# Altium project 36V E-Bike Reference Design.PrjPCB (part 2 of 4)

## Sheet INVERTER.SchDoc
size B; CompanyName: Microchip Technology Inc.; Organization: Microchip Technology; Address1: 2355 West Chandler Blvd.; Address2: Chandler, AZ  85224; Address4: USA; DocumentNumber: 2; SheetNumber: 2; SheetTotal: 3; SheetTitle: MOSFET DRIVER + INVERTER; Time: Time
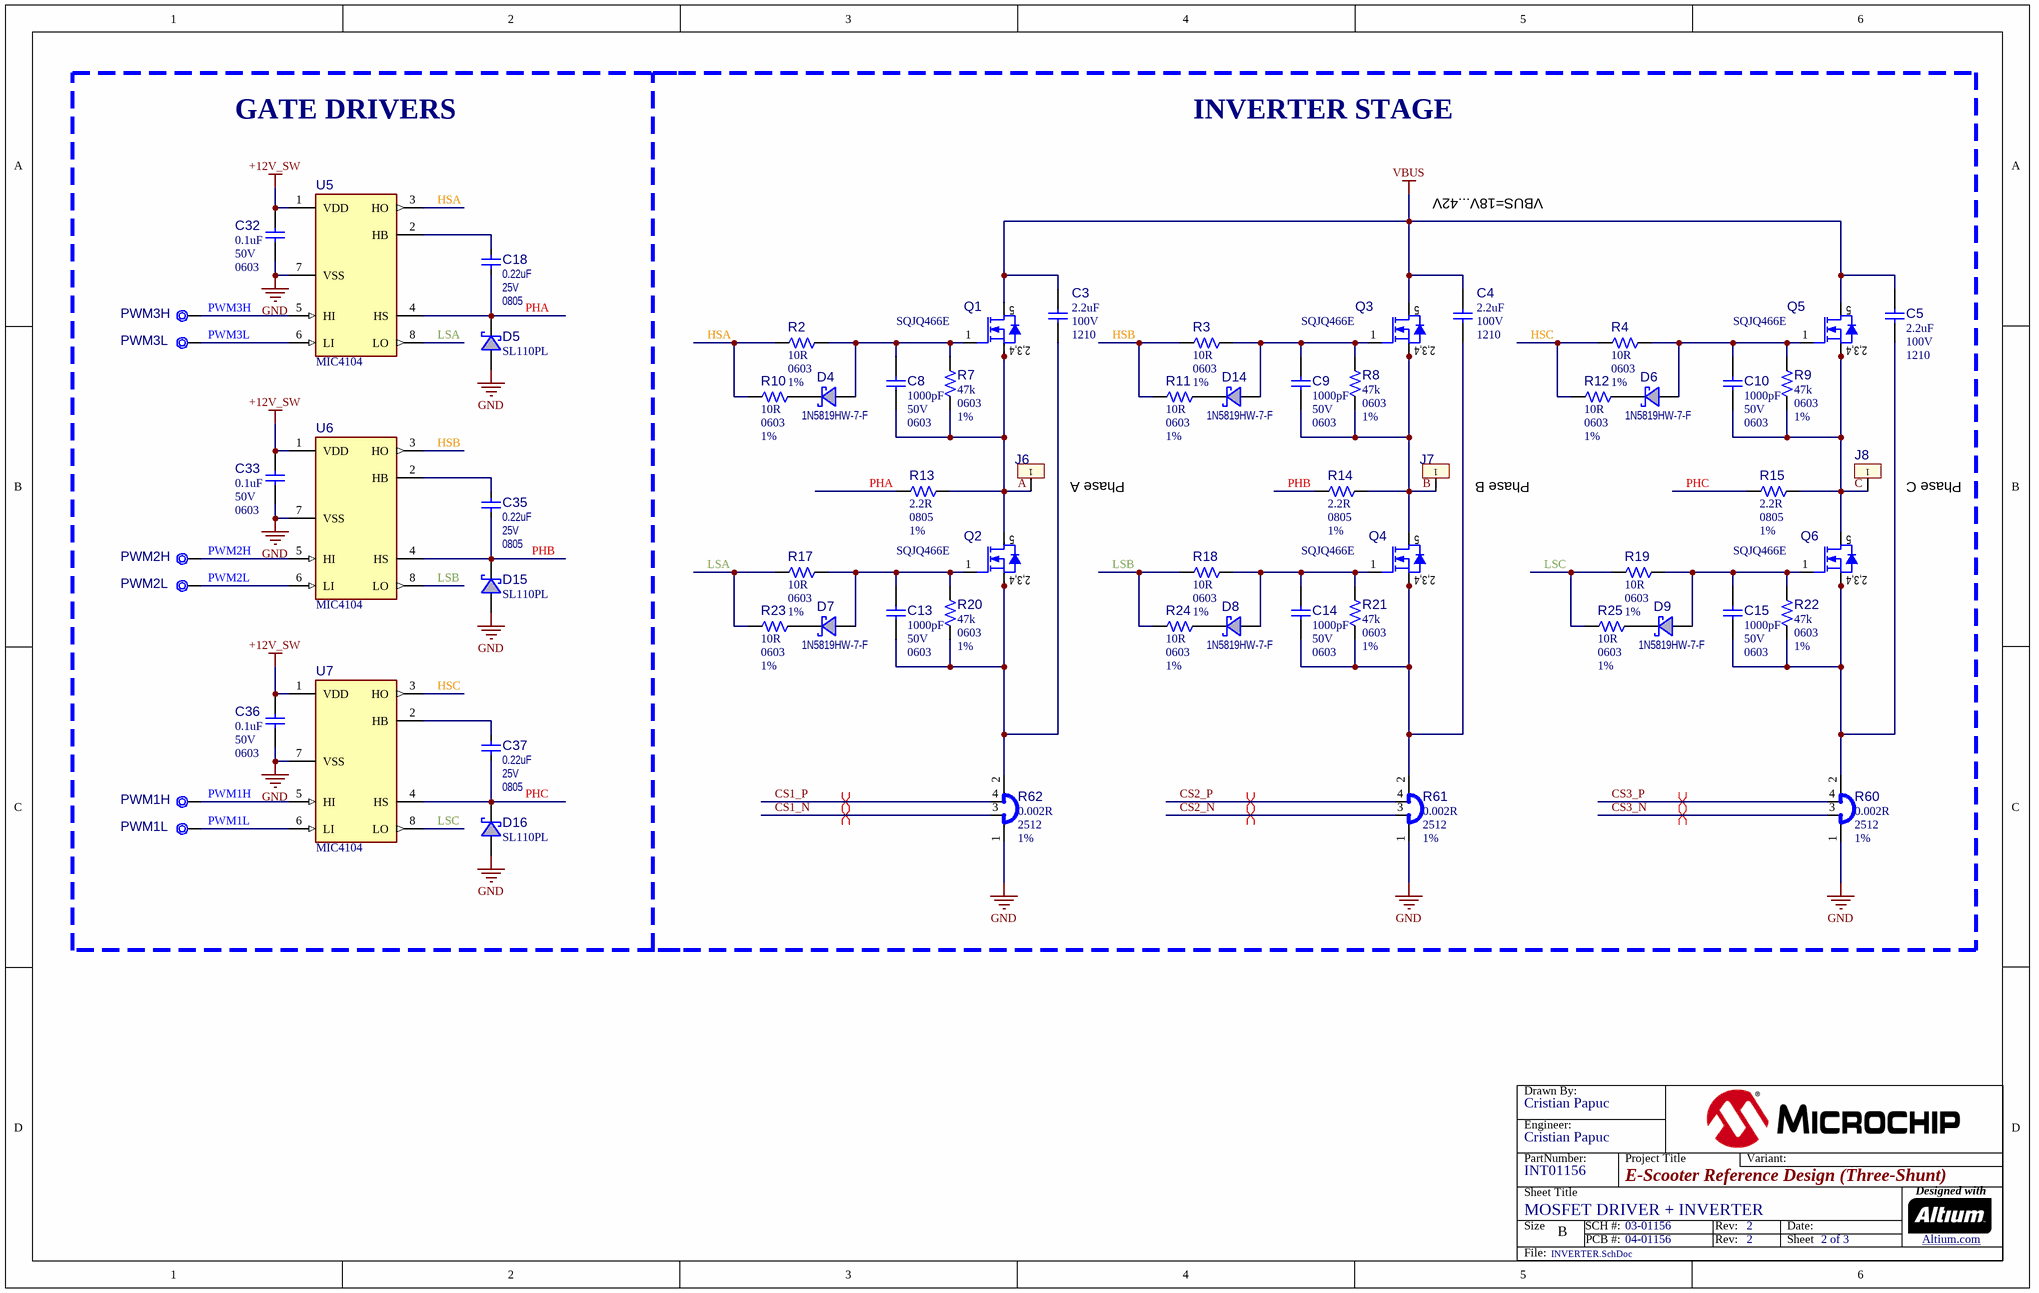
[diagram p1: INVERTER.SchDoc]

### Parts
(Parts that share a designator on the sheet are numbered #1, #2 ... from top to bottom, then left to right.)
?#2  (no value)  (graphical)
C3  value 2.2uF  Voltage: 100V  Package: 1210  [CAP_C_1210]  (hidden comment: Capacitor NP)
C4  value 2.2uF  Voltage: 100V  Package: 1210  [CAP_C_1210]  (hidden comment: Capacitor NP)
C5  value 2.2uF  Voltage: 100V  Package: 1210  [CAP_C_1210]  (hidden comment: Capacitor NP)
C8  value 1000pF  Voltage: 50V  Package: 0603  [CAP_C_0603]  (hidden comment: Capacitor NP)
C9  value 1000pF  Voltage: 50V  Package: 0603  [CAP_C_0603]  (hidden comment: Capacitor NP)
C10  value 1000pF  Voltage: 50V  Package: 0603  [CAP_C_0603]  (hidden comment: Capacitor NP)
C13  value 1000pF  Voltage: 50V  Package: 0603  [CAP_C_0603]  (hidden comment: Capacitor NP)
C14  value 1000pF  Voltage: 50V  Package: 0603  [CAP_C_0603]  (hidden comment: Capacitor NP)
C15  value 1000pF  Voltage: 50V  Package: 0603  [CAP_C_0603]  (hidden comment: Capacitor NP)
C18  value 0.22uF  Voltage: 25V  Package: 0805  [CAP_C_0805]  (hidden comment: Capacitor NP)
C32  value 0.1uF  Voltage: 50V  Package: 0603  [CAP_C_0603]  (hidden comment: Capacitor NP)
C33  value 0.1uF  Voltage: 50V  Package: 0603  [CAP_C_0603]  (hidden comment: Capacitor NP)
C35  value 0.22uF  Voltage: 25V  Package: 0805  [CAP_C_0805]  (hidden comment: Capacitor NP)
C36  value 0.1uF  Voltage: 50V  Package: 0603  [CAP_C_0603]  (hidden comment: Capacitor NP)
C37  value 0.22uF  Voltage: 25V  Package: 0805  [CAP_C_0805]  (hidden comment: Capacitor NP)
D4  value 1N5819HW-7-F  [SOD-123]  (hidden comment: Diode Schottky)
D5  value SL110PL  [SOD-123FL]  (hidden comment: Diode Schottky)
D6  value 1N5819HW-7-F  [SOD-123]  (hidden comment: Diode Schottky)
D7  value 1N5819HW-7-F  [SOD-123]  (hidden comment: Diode Schottky)
D8  value 1N5819HW-7-F  [SOD-123]  (hidden comment: Diode Schottky)
D9  value 1N5819HW-7-F  [SOD-123]  (hidden comment: Diode Schottky)
D14  value 1N5819HW-7-F  [SOD-123]  (hidden comment: Diode Schottky)
D15  value SL110PL  [SOD-123FL]  (hidden comment: Diode Schottky)
D16  value SL110PL  [SOD-123FL]  (hidden comment: Diode Schottky)
J6  Header 1x1  [CON_M_1x1_5.08_QC_TAB_SPADE_0.250_V]  (value not drawn)
J7  Header 1x1  [CON_M_1x1_5.08_QC_TAB_SPADE_0.250_V]  (value not drawn)
J8  Header 1x1  [CON_M_1x1_5.08_QC_TAB_SPADE_0.250_V]  (value not drawn)
PWM1H  Test Point No BOM  [TP_1.2x0.7]  (value not drawn)  (no BOM)
PWM1L  Test Point No BOM  [TP_1.2x0.7]  (value not drawn)  (no BOM)
PWM2H  Test Point No BOM  [TP_1.2x0.7]  (value not drawn)  (no BOM)
PWM2L  Test Point No BOM  [TP_1.2x0.7]  (value not drawn)  (no BOM)
PWM3H  Test Point No BOM  [TP_1.2x0.7]  (value not drawn)  (no BOM)
PWM3L  Test Point No BOM  [TP_1.2x0.7]  (value not drawn)  (no BOM)
Q1  value SQJQ466E  [PPAK_SO-8L_8x8_ALTERNATE]  (hidden comment: Transistor MOS-N GSSSD)
Q2  value SQJQ466E  [PPAK_SO-8L_8x8_ALTERNATE]  (hidden comment: Transistor MOS-N GSSSD)
Q3  value SQJQ466E  [PPAK_SO-8L_8x8_ALTERNATE]  (hidden comment: Transistor MOS-N GSSSD)
Q4  value SQJQ466E  [PPAK_SO-8L_8x8_ALTERNATE]  (hidden comment: Transistor MOS-N GSSSD)
Q5  value SQJQ466E  [PPAK_SO-8L_8x8_ALTERNATE]  (hidden comment: Transistor MOS-N GSSSD)
Q6  value SQJQ466E  [PPAK_SO-8L_8x8_ALTERNATE]  (hidden comment: Transistor MOS-N GSSSD)
R2  value 10R  Package: 0603  Tolerance: 1%  [RES_C_0603]  (hidden comment: Resistor)
R3  value 10R  Package: 0603  Tolerance: 1%  [RES_C_0603]  (hidden comment: Resistor)
R4  value 10R  Package: 0603  Tolerance: 1%  [RES_C_0603]  (hidden comment: Resistor)
R7  value 47k  Package: 0603  Tolerance: 1%  [RES_C_0603]  (hidden comment: Resistor)
R8  value 47k  Package: 0603  Tolerance: 1%  [RES_C_0603]  (hidden comment: Resistor)
R9  value 47k  Package: 0603  Tolerance: 1%  [RES_C_0603]  (hidden comment: Resistor)
R10  value 10R  Package: 0603  Tolerance: 1%  [RES_C_0603]  (hidden comment: Resistor)
R11  value 10R  Package: 0603  Tolerance: 1%  [RES_C_0603]  (hidden comment: Resistor)
R12  value 10R  Package: 0603  Tolerance: 1%  [RES_C_0603]  (hidden comment: Resistor)
R13  value 2.2R  Package: 0805  Tolerance: 1%  [RES_C_0805]  (hidden comment: Resistor)
R14  value 2.2R  Package: 0805  Tolerance: 1%  [RES_C_0805]  (hidden comment: Resistor)
R15  value 2.2R  Package: 0805  Tolerance: 1%  [RES_C_0805]  (hidden comment: Resistor)
R17  value 10R  Package: 0603  Tolerance: 1%  [RES_C_0603]  (hidden comment: Resistor)
R18  value 10R  Package: 0603  Tolerance: 1%  [RES_C_0603]  (hidden comment: Resistor)
R19  value 10R  Package: 0603  Tolerance: 1%  [RES_C_0603]  (hidden comment: Resistor)
R20  value 47k  Package: 0603  Tolerance: 1%  [RES_C_0603]  (hidden comment: Resistor)
R21  value 47k  Package: 0603  Tolerance: 1%  [RES_C_0603]  (hidden comment: Resistor)
R22  value 47k  Package: 0603  Tolerance: 1%  [RES_C_0603]  (hidden comment: Resistor)
R23  value 10R  Package: 0603  Tolerance: 1%  [RES_C_0603]  (hidden comment: Resistor)
R24  value 10R  Package: 0603  Tolerance: 1%  [RES_C_0603]  (hidden comment: Resistor)
R25  value 10R  Package: 0603  Tolerance: 1%  [RES_C_0603]  (hidden comment: Resistor)
R60  value 0.002R  Package: 2512  Tolerance: 1%  [RES_C_2512_SHUNT_Metal]  (hidden comment: Shunt 4 Pin)
R61  value 0.002R  Package: 2512  Tolerance: 1%  [RES_C_2512_SHUNT_Metal]  (hidden comment: Shunt 4 Pin)
R62  value 0.002R  Package: 2512  Tolerance: 1%  [RES_C_2512_SHUNT_Metal]  (hidden comment: Shunt 4 Pin)
U5  value MIC4104  [SOIC-8]  (hidden comment: MIC4104 SOIC-8)
U6  value MIC4104  [SOIC-8]  (hidden comment: MIC4104 SOIC-8)
U7  value MIC4104  [SOIC-8]  (hidden comment: MIC4104 SOIC-8)

### Blocks framed on the sheet
INVERTER STAGE: C3-C5 C8-C10 C13-C15 D4 D6-D9 D14 J6-J8 Q1-Q6 R2-R4 R7-R15 R17-R25 R60-R62

### Nets
+12V_SW: C32.2 C33.2 C36.2 U5.1(VDD) U6.1(VDD) U7.1(VDD)
GND: C32.1 C33.1 C36.1 D5.1(A) D15.1(A) D16.1(A) R60.1 R61.1 R62.1 U5.7(VSS) U6.7(VSS) U7.7(VSS)
VBUS: C3.2 C4.2 C5.2 Q1.5(D) Q3.5(D) Q5.5(D)
A: C8.1 J6.1 Q1.2(S) Q1.3(S) Q1.4(S) Q2.5(D) R7.1 R13.2
B: C9.1 J7.1 Q3.2(S) Q3.3(S) Q3.4(S) Q4.5(D) R8.1 R14.2
C: C10.1 J8.1 Q5.2(S) Q5.3(S) Q5.4(S) Q6.5(D) R9.1 R15.2
CS1_N: R62.3
CS1_P: R62.4
CS2_N: R61.3
CS2_P: R61.4
CS3_N: R60.3
CS3_P: R60.4
HSA: R2.1 R10.1 U5.3(HO)
HSB: R3.1 R11.1 U6.3(HO)
HSC: R4.1 R12.1 U7.3(HO)
LSA: R17.1 R23.1 U5.8(LO)
LSB: R18.1 R24.1 U6.8(LO)
LSC: R19.1 R25.1 U7.8(LO)
PHA: C18.1 D5.2(K) R13.1 U5.4(HS)
PHB: C35.1 D15.2(K) R14.1 U6.4(HS)
PHC: C37.1 D16.2(K) R15.1 U7.4(HS)
PWM1H: PWM1H.1 U7.5(HI)
PWM1L: PWM1L.1 U7.6(LI)
PWM2H: PWM2H.1 U6.5(HI)
PWM2L: PWM2L.1 U6.6(LI)
PWM3H: PWM3H.1 U5.5(HI)
PWM3L: PWM3L.1 U5.6(LI)
NetC3_1: C3.1 C13.1 Q2.2(S) Q2.3(S) Q2.4(S) R20.1 R62.2
NetC4_1: C4.1 C14.1 Q4.2(S) Q4.3(S) Q4.4(S) R21.1 R61.2
NetC5_1: C5.1 C15.1 Q6.2(S) Q6.3(S) Q6.4(S) R22.1 R60.2
NetC8_2: C8.2 D4.1(A) Q1.1(G) R2.2 R7.2
NetC9_2: C9.2 D14.1(A) Q3.1(G) R3.2 R8.2
NetC10_2: C10.2 D6.1(A) Q5.1(G) R4.2 R9.2
NetC13_2: C13.2 D7.1(A) Q2.1(G) R17.2 R20.2
NetC14_2: C14.2 D8.1(A) Q4.1(G) R18.2 R21.2
NetC15_2: C15.2 D9.1(A) Q6.1(G) R19.2 R22.2
NetC18_2: C18.2 U5.2(HB)
NetC35_2: C35.2 U6.2(HB)
NetC37_2: C37.2 U7.2(HB)
NetD4_2: D4.2(K) R10.2
NetD6_2: D6.2(K) R12.2
NetD7_2: D7.2(K) R23.2
NetD8_2: D8.2(K) R24.2
NetD9_2: D9.2(K) R25.2
NetD14_2: D14.2(K) R11.2

### Layout directives
differential pair: CS1_N, CS1_P, CS2_N, CS2_P, CS3_N, CS3_P

### Notes on the sheet
- GATE DRIVERS
- VBUS=18V...42V
- (near J6) Phase A
- (near J7) Phase B
- (near J8) Phase C
- Drawn By:
- Engineer:
- PartNumber:
- Project Title
- Variant:
- Sheet Title
- Size
- B
- SCH #:
- PCB #:
- Rev:
- Date:
- Sheet
- Designed with
- Altium.com <http://go.altium.com/MicrochipLandingPage_Evaluation.html>
- File:
- (in symbol TRA1472) 2,3,4

### Library data of the parts
?#2 = Title Block B
C3-C5 = CAP1121: Capacitor; Manufacturer 1: AVX Corporation; Manufacturer Part Number 1: 12101C225KAT2A; Description_: CAP CER 2.2uF 100V 10% X7R SMD 1210; Dev Tools Status: Production; Tolerance: 10%; Temperature Coeffcient: X7R; Type: Ceramic; Owner: Mihai T(M91442); Populated: YES; MCHP-ID: CAP1121; Revision: 0; Symbol: Capacitor NP; Status: MCL Design; ComponentLink1URL: https://chn-vm-apps.microchip.com/mchprepo/parts/Datasheets/X7RDielectric.pdf; ComponentLink1Description: SVN Datasheet; ComponentLink2URL: C:\ALTIUM_WORK\00001_MCHP-CDB\Datasheets\X7RDielectric.pdf; ComponentLink2Description: Local Datasheet; ComponentLink3URL: C:\ALTIUM_WORK\00001_MCHP-CDB\Library\LibraryRefs\Capacitor NP.SchLib; ComponentLink3Description: Open Symbol; ComponentLink4URL: C:\ALTIUM_WORK\00001_MCHP-CDB\Library\Footprints\CAP_C_1210.PcbLib; ComponentLink4Description: Open Footprint; ComponentLink5Description: Open Footprint 2; ComponentLink6Description: Open Footprint 3; ComponentLink7Description: Open Footprint 4; Operating Temperature: -55C to +125C; Category: Capacitor; Manufacturer 2: KEMET; Manufacturer Part Number 2: C1210C225K1RACTU; Supplier 1: Digi-Key; Supplier Part Number 1: 478-7974-1-ND; Supplier 2: Digi-Key; Supplier Part Number 2: 399-5511-1-ND; Supplier 3: Farnell; Supplier Part Number 3: 1793832; Quantity Override: 1
C8-C10 C13-C15 = CAP2035: Manufacturer 1: TDK Corporation; Manufacturer Part Number 1: CGA3E2X7R1H102K080AA; Description_: CAP CER 1000pF 10% 50V X7R SMD 0603 AEC-Q200; Dev Tools Status: Design; Tolerance: 10%; Temperature Coeffcient: X7R; Type: Ceramic; Owner: Gabor Bihari; Populated: YES; MCHP-ID: CAP2035; Revision: 1; Symbol: Capacitor NP; Status: MCL Design; ComponentLink1URL: https://chn-vm-apps.microchip.com/mchprepo/parts/Datasheets/mlcc_automotive_general_en.pdf; ComponentLink1Description: SVN Datasheet; ComponentLink2URL: C:\ALTIUM_WORK\00001_MCHP-CDB\Datasheets\mlcc_automotive_general_en.pdf; ComponentLink2Description: Local Datasheet; ComponentLink3URL: C:\ALTIUM_WORK\00001_MCHP-CDB\Library\LibraryRefs\Capacitor NP.SchLib; ComponentLink3Description: Open Symbol; ComponentLink4URL: C:\ALTIUM_WORK\00001_MCHP-CDB\Library\Footprints\CAP_C_0603.PcbLib; ComponentLink4Description: Open Footprint; ComponentLink5Description: Open Footprint 2; ComponentLink6Description: Open Footprint 3; ComponentLink7Description: Open Footprint 4; Operating Temperature: -55°C - 125°C; Category: Capacitor; Supplier 1: Digi-Key; Supplier Part Number 1: 445-5659-1-ND; Quantity Override: 1
C18 C35 C37 = CAP0135: Manufacturer 1: Panasonic; Manufacturer Part Number 1: ECJ-2YB1E224K; Description_: CAP CER 0.22uF 25V 10% X7R SMD 0805; Dev Tools Status: Production; Tolerance: 10%; Temperature Coeffcient: X7R; Type: Ceramic; Populated: Yes; MCHP-ID: CAP0135; Revision: 1; Symbol: Capacitor NP; Status: MCL Design; ComponentLink1URL: https://chn-vm-apps.microchip.com/mchprepo/parts/Datasheets/general_B11.pdf; ComponentLink1Description: SVN Datasheet; ComponentLink2URL: C:\ALTIUM_WORK\00001_MCHP-CDB\Datasheets\general_B11.pdf; ComponentLink2Description: Local Datasheet; ComponentLink3URL: C:\ALTIUM_WORK\00001_MCHP-CDB\Library\LibraryRefs\Capacitor NP.SchLib; ComponentLink3Description: Open Symbol; ComponentLink4URL: C:\ALTIUM_WORK\00001_MCHP-CDB\Library\Footprints\CAP_C_0805.PcbLib; ComponentLink4Description: Open Footprint; ComponentLink5Description: Open Footprint 2; ComponentLink6Description: Open Footprint 3; ComponentLink7Description: Open Footprint 4; Operating Temperature: -55C to +125C; Category: Capacitor; Supplier 1: Digi-Key; Supplier Part Number 1: PCC1832CT-ND; Quantity Override: 1; Manufacturer 2: TDK; Manufacturer Part Number 2: C2012X7R1E224K; Supplier 2: Digi-Key; Supplier Part Number 2: 445-1352-1-ND
C32 C33 C36 = CAP2016: Capacitor; Manufacturer 1: AVX Corporation; Manufacturer Part Number 1: 06035C104K4Z4A; Description_: CAP CER 0.1uF 50V 10% X7R AEC-Q200 SMD 0603; Dev Tools Status: Design; Tolerance: 10%; Temperature Coeffcient: X7R; Type: Ceramic; Owner: Sam Charles; Populated: YES; MCHP-ID: CAP2016; Revision: A; Symbol: Capacitor NP; Status: MCL Design; ComponentLink1URL: https://chn-vm-apps.microchip.com/mchprepo/parts/Datasheets/FlexitermMLCC.pdf; ComponentLink1Description: SVN Datasheet; ComponentLink2URL: C:\ALTIUM_WORK\00001_MCHP-CDB\Datasheets\FlexitermMLCC.pdf; ComponentLink2Description: Local Datasheet; ComponentLink3URL: C:\ALTIUM_WORK\00001_MCHP-CDB\Library\LibraryRefs\Capacitor NP.SchLib; ComponentLink3Description: Open Symbol; ComponentLink4URL: C:\ALTIUM_WORK\00001_MCHP-CDB\Library\Footprints\CAP_C_0603.PcbLib; ComponentLink4Description: Open Footprint; ComponentLink5Description: Open Footprint 2; ComponentLink6Description: Open Footprint 3; ComponentLink7Description: Open Footprint 4; Operating Temperature: -55°C ~ 125°C; Category: Capacitor; Supplier 1: Digi-Key; Supplier Part Number 1: 478-10679-1-ND; Quantity Override: 1
D4 D6-D9 D14 = DIODE1233: DIO SCTKY RB160M-60TR 550mV 1A 60V SMD SOD-123F; Manufacturer 1: Diodes Incorporated; Description_: DIODE SCTKY 1N5819HW-7-F 450mV 1A 40V SMD SOD-123; Dev Tools Status: Design; Type: Schottky Single; Power: 450mW; Reverse Current: 1mA; Reverse Recovery Time: 500ns; Reverse Voltage: 40V; Owner: Sorin Stanoaia; Populated: YES; MCHP-ID: DIODE1233; Revision: A; Symbol: Diode Schottky; Status: MCL Design; Package: SOD-123; ComponentLink1URL: https://chn-vm-apps.microchip.com/mchprepo/parts/Datasheets/ds30217.pdf; ComponentLink1Description: SVN Datasheet; ComponentLink2URL: C:\ALTIUM_WORK\00001_MCHP-CDB\Datasheets\ds30217.pdf; ComponentLink2Description: Local Datasheet; ComponentLink3URL: C:\ALTIUM_WORK\00001_MCHP-CDB\Library\LibraryRefs\Diode Schottky.SchLib; ComponentLink3Description: Open Symbol; ComponentLink4URL: C:\ALTIUM_WORK\00001_MCHP-CDB\Library\Footprints\SOD-123.PcbLib; ComponentLink4Description: Open Footprint; ComponentLink5Description: Open Footprint 2; ComponentLink6Description: Open Footprint 3; ComponentLink7Description: Open Footprint 4; Operating Temperature: -65C to +125C; Category: Diode; Forward Current: 1A; Manufacturer Part Number 1: 1N5819HW-7-F; Supplier 1: Digi-Key; Supplier Part Number 1: 1N5819HW-FDICT-ND; Quantity Override: 1
D5 D15 D16 = DIODE1296: DIO SCTKY RB160M-60TR 550mV 1A 60V SMD SOD-123F; Manufacturer 1: Micro Commercial Co; Manufacturer Part Number 1: SL110PL-TP; Description_: DIO SCTKY  SL110PL-TP 600mV 1A 100V SOD-123FL; Dev Tools Status: Design; Type: Schottky Single; Reverse Recovery Time: 500ns; Reverse Voltage: 100V; Owner: Tad Ahlvers; Populated: YES; MCHP-ID: DIODE1296; Revision: A; Symbol: Diode Schottky; Status: MCL Design; Package: SOD-123FL; ComponentLink1URL: https://chn-vm-apps.microchip.com/mchprepo/parts/Datasheets/SL14PL-SL110PL(SOD-123FL)-A.pdf; ComponentLink1Description: SVN Datasheet; ComponentLink2URL: C:\ALTIUM_WORK\00001_MCHP-CDB\Datasheets\SL14PL-SL110PL(SOD-123FL)-A.pdf; ComponentLink2Description: Local Datasheet; ComponentLink3URL: C:\ALTIUM_WORK\00001_MCHP-CDB\Library\LibraryRefs\Diode Schottky.SchLib; ComponentLink3Description: Open Symbol; ComponentLink4URL: C:\ALTIUM_WORK\00001_MCHP-CDB\Library\Footprints\SOD-123FL.PcbLib; ComponentLink4Description: Open Footprint; ComponentLink5Description: Open Footprint 2; ComponentLink6Description: Open Footprint 3; ComponentLink7Description: Open Footprint 4; Operating Temperature: -55C to +150C; Category: Diode; Forward Current: 1A; Supplier 1: Digi-Key; Supplier Part Number 1: SL110PL-TPMSCT-ND; Quantity Override: 1
J6-J8 = CON2208: CON HDR-2.54 Male 1x1 Gold 5.97MH TH VERT; Manufacturer 1: TE Connectivity AMP Connectors; Manufacturer Part Number 1: 1-726386-2; Value: TERMINAL 1x1; Description_: CON CONTACT QC TAB 0.250 Male 1x1 TH VERT; Dev Tools Status: Design; Owner: Octavian Stroe; Populated: YES; MCHP-ID: CON2208; Revision: A; Symbol: Header 1x1; Status: MCL Design; ComponentLink1URL: https://chn-vm-apps.microchip.com/mchprepo/parts/Datasheets/ENG_CD_726386_G1.pdf; ComponentLink1Description: SVN Datasheet; ComponentLink2URL: C:\ALTIUM_WORK\00001_MCHP-CDB\Datasheets\ENG_CD_726386_G1.pdf; ComponentLink2Description: Local Datasheet; ComponentLink3URL: C:\ALTIUM_WORK\00001_MCHP-CDB\Library\LibraryRefs\Header 1x1.SchLib; ComponentLink3Description: Open Symbol; ComponentLink4URL: C:\ALTIUM_WORK\00001_MCHP-CDB\Library\Footprints\CON_M_1x1_5.08_QC_TAB_SPADE_0.250_V.PcbLib; ComponentLink4Description: Open Footprint; ComponentLink5Description: Open Footprint 2; ComponentLink6Description: Open Footprint 3; ComponentLink7Description: Open Footprint 4; Type: Contact; Category: Connector; Supplier 1: Digi-Key; Supplier Part Number 1: A122560-ND; Quantity Override: 1
PWM1H PWM1L PWM2H PWM2L PWM3H PWM3L = CON1128: Test Point; Value: TP PAD PCB 1.2x0.7; Description_: CON TP PAD PCB 1.2x0.7 TH; Dev Tools Status: Production; Owner: Bogdan P (M91398); Populated: Yes; MCHP-ID: CON1128; Revision: 0; Status: MCL Design; ComponentLink1Description: SVN Datasheet; Type: Test Point; Category: Connector; Quantity Override: 1; ComponentLink2Description: Local Datasheet; ComponentLink3Description: Open Symbol; ComponentLink3URL: C:\ALTIUM_WORK\00001_MCHP-CDB\Library\LibraryRefs\Test Point No BOM.SchLib; ComponentLink4Description: Open Footprint; ComponentLink4URL: C:\ALTIUM_WORK\00001_MCHP-CDB\Library\Footprints\TP_1.2x0.7.PcbLib; ComponentLink5Description: Open Footprint 2; ComponentLink6Description: Open Footprint 3; ComponentLink7Description: Open Footprint 4; Symbol: Test Point No BOM
Q1-Q6 = TRA1472: Transistor MOS; Manufacturer 1: Vishay Siliconix; Manufacturer Part Number 1: SQJQ466E-T1_GE3; Description_: TRANS FET N-CH SQJQ466E 60V 200A PowerPAK SO-8L AEC-Q101; Dev Tools Status: Design; Type: FET; Current: 200A; Drain to Source Voltage: 60V; Gate to Source Voltage: 20V; Power: 150W; Owner: Octavian Stroe; Populated: YES; MCHP-ID: TRA1472; Revision: 1; Symbol: Transistor MOS-N GSSSD; Status: MCL Design; Package: PowerPAK SO-8L; ComponentLink1URL: https://chn-vm-apps.microchip.com/mchprepo/parts/Datasheets/sqjq466e.pdf; ComponentLink1Description: SVN Datasheet; ComponentLink2URL: C:\ALTIUM_WORK\00001_MCHP-CDB\Datasheets\sqjq466e.pdf; ComponentLink2Description: Local Datasheet; ComponentLink3URL: C:\ALTIUM_WORK\00001_MCHP-CDB\Library\LibraryRefs\Transistor MOS-N GSSSD.SchLib; ComponentLink3Description: Open Symbol; ComponentLink4URL: C:\ALTIUM_WORK\00001_MCHP-CDB\Library\Footprints\PPAK_SO-8L_8x8.PcbLib; ComponentLink4Description: Open Footprint; ComponentLink5Description: Open Footprint 2; ComponentLink6Description: Open Footprint 3; ComponentLink7Description: Open Footprint 4; Category: Transistor; Voltage: 60V; Supplier 1: Digi-Key; Supplier Part Number 1: SQJQ466E-T1_GE3CT-ND; Quantity Override: 1; ComponentLink7URL: C:\ALTIUM_WORK\00001_MCHP-CDB\Library\Footprints\PPAK_SO-8L_8x8_ALTERNATE.PcbLib; Operating Temperature: -55C to +175C
R2-R4 R10-R12 R23-R25 = RSMT0456: Manufacturer 1: Panasonic; Manufacturer Part Number 1: ERJ-3EKF10R0V; Description_: RES TKF 10R 1% 1/10W SMD 0603; Dev Tools Status: Production; Voltage: 75V; Temperature Coeffcient: 100ppm/C; Power: 1/10W; Populated: Yes; MCHP-ID: RSMT0456; Revision: 2; Symbol: Resistor; Status: MCL Design; ComponentLink1URL: https://chn-vm-apps.microchip.com/mchprepo/parts/Datasheets/AOA0000CE2.pdf; ComponentLink1Description: SVN Datasheet; ComponentLink2URL: C:\ALTIUM_WORK\00001_MCHP-CDB\Datasheets\AOA0000CE2.pdf; ComponentLink2Description: Local Datasheet; ComponentLink3URL: C:\ALTIUM_WORK\00001_MCHP-CDB\Library\LibraryRefs\Resistor.SchLib; ComponentLink3Description: Open Symbol; ComponentLink4URL: C:\ALTIUM_WORK\00001_MCHP-CDB\Library\Footprints\RES_C_0603.PcbLib; ComponentLink4Description: Open Footprint; ComponentLink5Description: Open Footprint 2; ComponentLink6Description: Open Footprint 3; ComponentLink7Description: Open Footprint 4; Operating Temperature: -55C to +155C; Category: Resistor; Type: RES SMD; Composition: TKF; Manufacturer 2: Yageo; Manufacturer Part Number 2: RC0603FR-0710RL; Manufacturer 3: SET; Manufacturer Part Number 3: RMCF1/1610.01%TR; Supplier 1: Digi-Key; Supplier Part Number 1: P10.0HTR-ND; Supplier 2: Digi-Key; Supplier Part Number 2: 311-10.0HRCT-ND; Supplier 3: SET; Supplier Part Number 3: RMCF1/1610.01%TR; Quantity Override: 1
R7-R9 R20-R22 = RES1183: Manufacturer 1: Panasonic; Manufacturer Part Number 1: ERJ-3EKF4702V; Description_: RES TKF 47k 1% 1/10W SMD 0603; Dev Tools Status: Production; Voltage: 75V; Temperature Coeffcient: 100ppm/C; Power: 1/10W; Populated: YES; Owner: Adrian M (M91404); MCHP-ID: RES1183; Revision: 0; Symbol: Resistor; Status: MCL Design; ComponentLink1URL: https://chn-vm-apps.microchip.com/mchprepo/parts/Datasheets/AOA0000CE2.pdf; ComponentLink1Description: SVN Datasheet; ComponentLink2URL: C:\ALTIUM_WORK\00001_MCHP-CDB\Datasheets\AOA0000CE2.pdf; ComponentLink2Description: Local Datasheet; ComponentLink3URL: C:\ALTIUM_WORK\00001_MCHP-CDB\Library\LibraryRefs\Resistor.SchLib; ComponentLink3Description: Open Symbol; ComponentLink4URL: C:\ALTIUM_WORK\00001_MCHP-CDB\Library\Footprints\RES_C_0603.PcbLib; ComponentLink4Description: Open Footprint; ComponentLink5Description: Open Footprint 2; ComponentLink6Description: Open Footprint 3; ComponentLink7Description: Open Footprint 4; Operating Temperature: -55C to +155C; Category: Resistor; Type: RES SMD; Composition: TKF; Supplier 1: Digi-Key; Supplier Part Number 1: P47.0KHCT-ND; Quantity Override: 1
R13-R15 = RES2048: Manufacturer 1: Vishay Dale; Manufacturer Part Number 1: CRCW08052R20FKEA; Description_: RES TKF 2.2R 1% 1/8W SMD 0805 AEC-Q200; Dev Tools Status: Production; Voltage: 150V; Temperature Coeffcient: 100ppm/C; Power: 1/8W; Owner: Cristian Papuc; Populated: YES; MCHP-ID: RES2048; Revision: 1; Symbol: Resistor; Status: MCL Design; ComponentLink1URL: https://chn-vm-apps.microchip.com/mchprepo/parts/Datasheets/dcrcwe3.pdf; ComponentLink1Description: SVN Datasheet; ComponentLink2URL: C:\ALTIUM_WORK\00001_MCHP-CDB\Datasheets\dcrcwe3.pdf; ComponentLink2Description: Local Datasheet; ComponentLink3URL: C:\ALTIUM_WORK\00001_MCHP-CDB\Library\LibraryRefs\Resistor.SchLib; ComponentLink3Description: Open Symbol; ComponentLink4URL: C:\ALTIUM_WORK\00001_MCHP-CDB\Library\Footprints\RES_C_0805.PcbLib; ComponentLink4Description: Open Footprint; ComponentLink5Description: Open Footprint 2; ComponentLink6Description: Open Footprint 3; ComponentLink7Description: Open Footprint 4; Operating Temperature: -55C to +155C; Category: Resistor; Type: RES SMD; Composition: TKF; Supplier 1: Digi-Key; Supplier Part Number 1: 541-2.20CCCT-ND; Quantity Override: 1
R17-R19 = RSMT0456: Manufacturer 1: Panasonic; Manufacturer Part Number 1: ERJ-3EKF10R0V; Description_: RES TKF 10R 1% 1/10W SMD 0603; Dev Tools Status: Production; Temperature Coeffcient: 100ppm/C; Populated: Yes; Voltage: 75V; Power: 1/10W; MCHP-ID: RSMT0456; Revision: 2; Symbol: Resistor; Status: MCL Design; ComponentLink1URL: https://chn-vm-apps.microchip.com/mchprepo/parts/Datasheets/AOA0000CE2.pdf; ComponentLink1Description: SVN Datasheet; ComponentLink2URL: C:\ALTIUM_WORK\00001_MCHP-CDB\Datasheets\AOA0000CE2.pdf; ComponentLink2Description: Local Datasheet; ComponentLink3URL: C:\ALTIUM_WORK\00001_MCHP-CDB\Library\LibraryRefs\Resistor.SchLib; ComponentLink3Description: Open Symbol; ComponentLink4URL: C:\ALTIUM_WORK\00001_MCHP-CDB\Library\Footprints\RES_C_0603.PcbLib; ComponentLink4Description: Open Footprint; ComponentLink5Description: Open Footprint 2; ComponentLink6Description: Open Footprint 3; ComponentLink7Description: Open Footprint 4; Operating Temperature: -55C to +155C; Category: Resistor; Type: RES SMD; Composition: TKF; Supplier 1: Digi-Key; Supplier Part Number 1: P10.0HTR-ND; Quantity Override: 1; Manufacturer 2: Yageo; Manufacturer Part Number 2: RC0603FR-0710RL; Manufacturer 3: SET; Manufacturer Part Number 3: RMCF1/1610.01%TR; Supplier 2: Digi-Key; Supplier Part Number 2: 311-10.0HRCT-ND; Supplier 3: SET; Supplier Part Number 3: RMCF1/1610.01%TR
R60-R62 = RES2539: Shunt; Manufacturer 1: Vishay Dale; Manufacturer Part Number 1: WSLF25122L000FEA; Description_: RES SHUNT ME 0.002R 1% 5W AEC-Q200 SMD 2512; Dev Tools Status: Design; Temperature Coeffcient: 70ppm/C; Power: 5W; Owner: Octavian Stroe; Populated: YES; MCHP-ID: RES2539; Revision: B; Symbol: Shunt 4 Pin; Status: MCL Design; ComponentLink1URL: https://chn-vm-apps.microchip.com/mchprepo/parts/Datasheets/wslf.pdf; ComponentLink1Description: SVN Datasheet; ComponentLink2URL: C:\ALTIUM_WORK\00001_MCHP-CDB\Datasheets\wslf.pdf; ComponentLink2Description: Local Datasheet; ComponentLink3URL: C:\ALTIUM_WORK\00001_MCHP-CDB\Library\LibraryRefs\Shunt 4 Pin.SchLib; ComponentLink3Description: Open Symbol; ComponentLink4URL: C:\ALTIUM_WORK\00001_MCHP-CDB\Library\Footprints\RES_C_2512_SHUNT_Metal.PcbLib; ComponentLink4Description: Open Footprint; ComponentLink5Description: Open Footprint 2; ComponentLink6Description: Open Footprint 3; ComponentLink7Description: Open Footprint 4; Operating Temperature: -65C to +170C; Category: Resistor; Type: Shunt; Composition: Metal Element; Supplier 1: Digi-Key; Supplier Part Number 1: 541-3126-1-ND; Quantity Override: 1
U5-U7 = MIC6432: MOSFET DRIVER; Manufacturer 1: Micrel Inc; Manufacturer Part Number 1: MIC4104YM; Description_: MCHP ANALOG FET DRIVER Dual-Non-Inverting MIC4104 SOIC-8; MAPS Description: 100V HalfBridge MOSFET Driver 3/2A SOURCE/SINK CURRENT TTL INPUT; Dev Tools Status: Design; Owner: Ed Kennedy; MPC: 2780143BXE01; LeadContent: Pb-FREE; PackingMedia: TUBE; Stage: REL; LeadCount: 8; PackageWidth: 3.90mm(.150in); ForceMinOrderQtyMult: False; MinOrderQty: 1; TempRange: -40C to +125C; tblDeviceFamilyID: 7802; PeakOutputCurrent: 3.0/2.0; Populated: YES; MCHP-ID: MIC6432; Symbol: MIC4104 SOIC-8; Type: FET Driver; Status: MCL Design; Revision: A; Category: MCHP-Analog; ComponentLink1URL: http://www.microchip.com/wwwproducts/MIC4104; ComponentLink1Description: SVN Datasheet; ComponentLink2Description: Local Datasheet; ComponentLink3URL: C:\ALTIUM_WORK\00001_MCHP-CDB\Library\LibraryRefs\MIC4104 SOIC-8.SchLib; ComponentLink3Description: Open Symbol; ComponentLink4URL: C:\ALTIUM_WORK\00001_MCHP-CDB\Library\Footprints\SOIC-8.PcbLib; ComponentLink4Description: Open Footprint; ComponentLink5Description: Open Footprint 2; ComponentLink6Description: Open Footprint 3; ComponentLink7Description: Open Footprint 4; Supplier 1: Digi-Key; Supplier Part Number 1: 576-1590-ND; IntroductionDate: 2007-01-08; PackageType: SOIC; Quantity Override: 1; ComponentLink2URL: C:\ALTIUM_WORK\00001_MCHP-CDB\Datasheets\mic4103-4.pdf

## Sheet POWER+HALL.SchDoc
size B; CompanyName: Microchip Technology Inc.; Organization: Microchip Technology; Address1: 2355 West Chandler Blvd.; Address2: Chandler, AZ  85224; Address4: USA; DocumentNumber: 3; SheetNumber: 3; SheetTotal: 3; SheetTitle: POWER+HALL; Time: Time
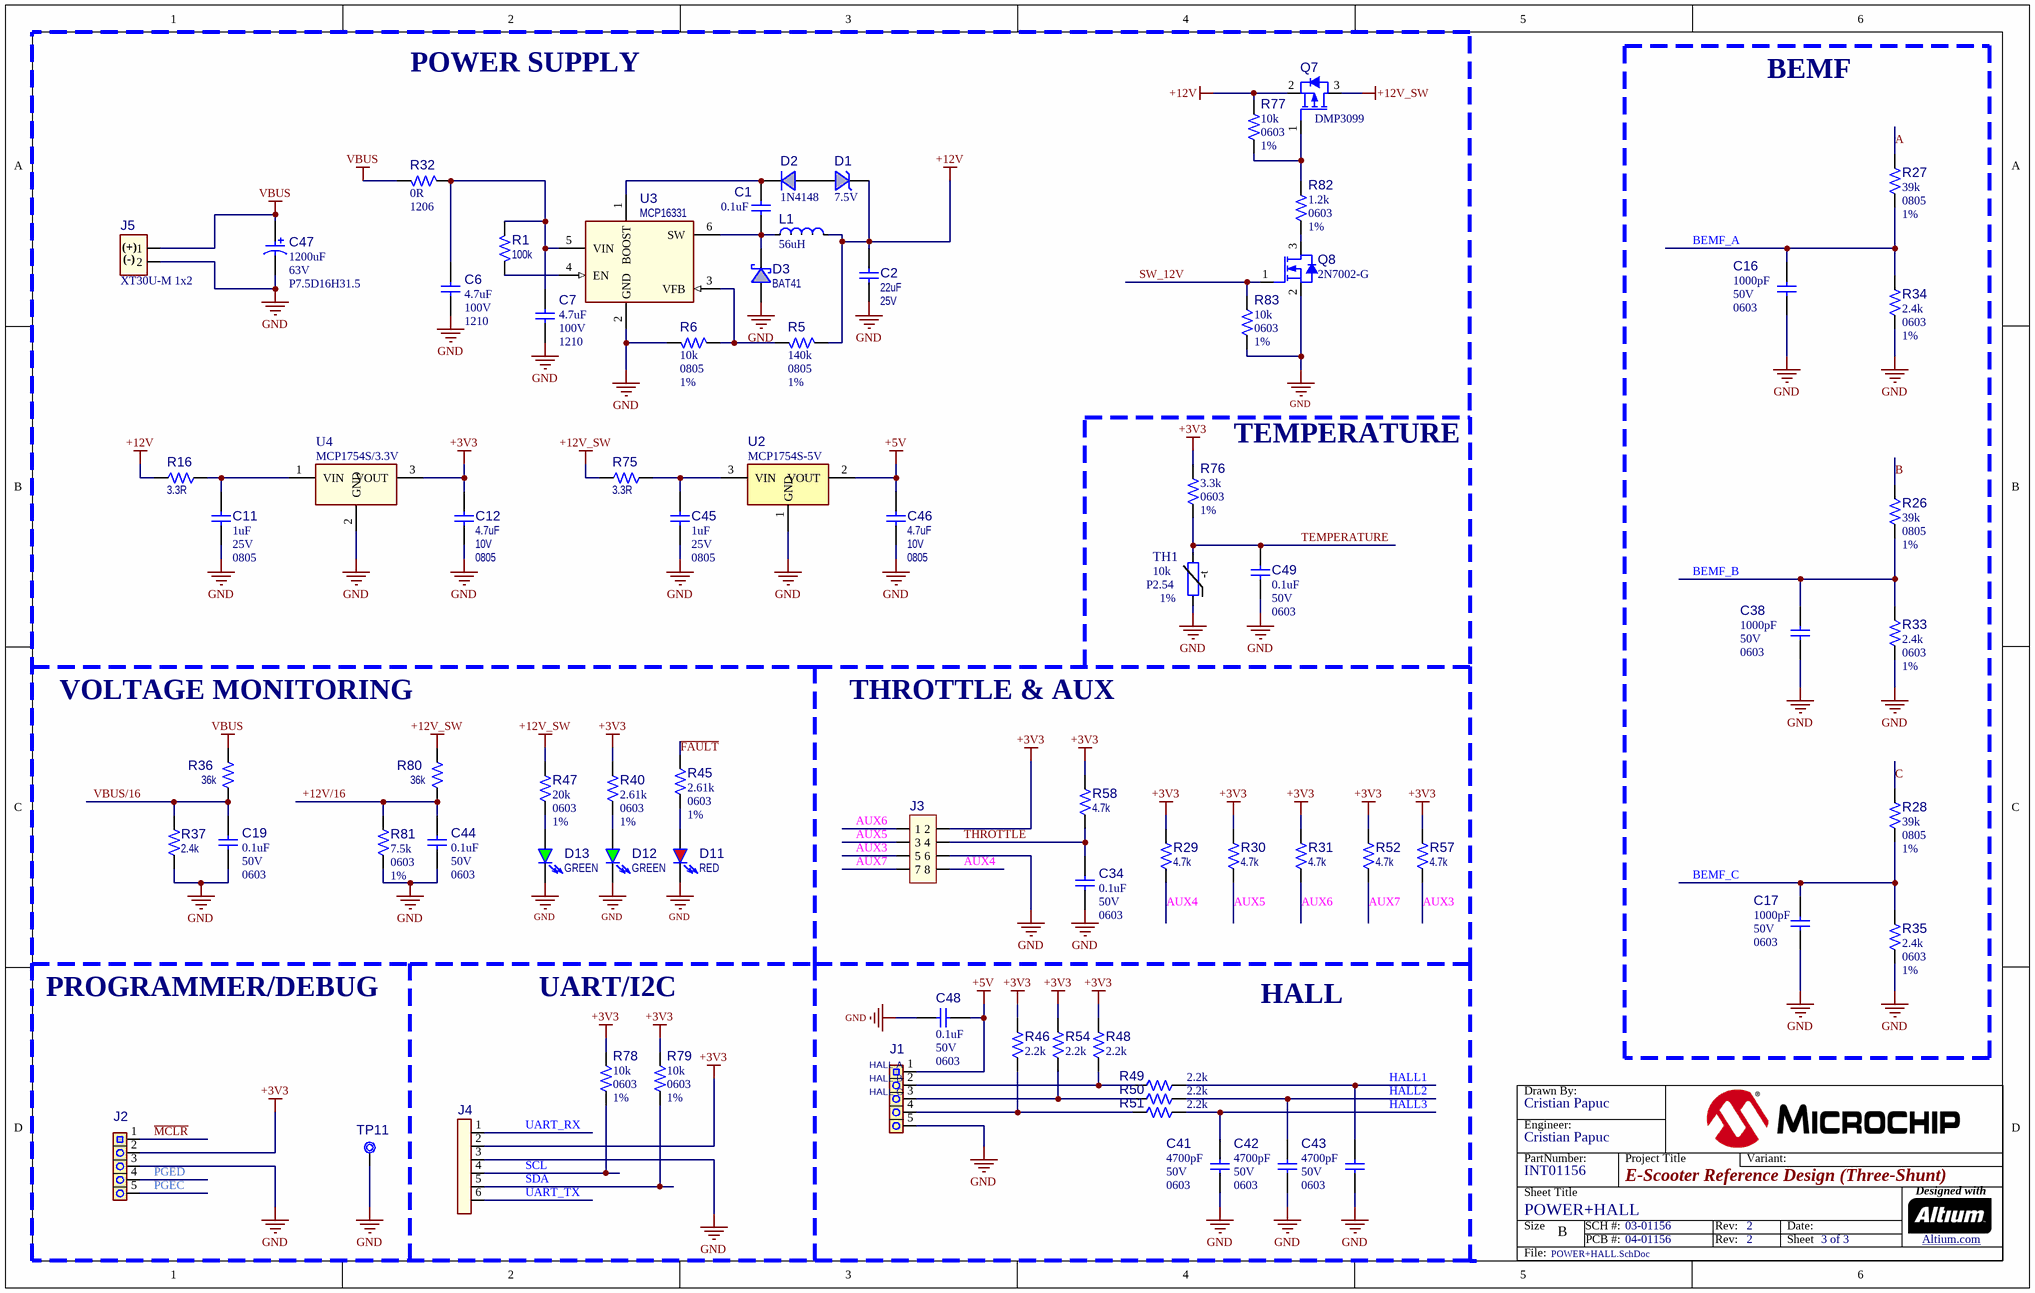
[diagram p2: POWER+HALL.SchDoc]

### Parts
(Parts that share a designator on the sheet are numbered #1, #2 ... from top to bottom, then left to right.)
?#3  (no value)  (graphical)
C1  value 0.1uF  [CAP_C_0603]  (hidden comment: Capacitor NP)
C2  value 22uF  Voltage: 25V  [CAP_C_1206]  (hidden comment: Capacitor NP)
C6  value 4.7uF  Voltage: 100V  Package: 1210  [CAP_C_1210]  (hidden comment: Capacitor NP)
C7  value 4.7uF  Voltage: 100V  Package: 1210  [CAP_C_1210]  (hidden comment: Capacitor NP)
C11  value 1uF  Voltage: 25V  Package: 0805  [CAP_C_0805]  (hidden comment: Capacitor NP)
C12  value 4.7uF  Voltage: 10V  Package: 0805  [CAP_C_0805]  (hidden comment: Capacitor NP)
C16  value 1000pF  Voltage: 50V  Package: 0603  [CAP_C_0603]  (hidden comment: Capacitor NP)
C17  value 1000pF  Voltage: 50V  Package: 0603  [CAP_C_0603]  (hidden comment: Capacitor NP)
C19  value 0.1uF  Voltage: 50V  Package: 0603  [CAP_C_0603]  (hidden comment: Capacitor NP)
C34  value 0.1uF  Voltage: 50V  Package: 0603  [CAP_C_0603]  (hidden comment: Capacitor NP)
C38  value 1000pF  Voltage: 50V  Package: 0603  [CAP_C_0603]  (hidden comment: Capacitor NP)
C41  value 4700pF  Voltage: 50V  Package: 0603  [CAP_C_0603]  (hidden comment: Capacitor NP)
C42  value 4700pF  Voltage: 50V  Package: 0603  [CAP_C_0603]  (hidden comment: Capacitor NP)
C43  value 4700pF  Voltage: 50V  Package: 0603  [CAP_C_0603]  (hidden comment: Capacitor NP)
C44  value 0.1uF  Voltage: 50V  Package: 0603  [CAP_C_0603]  (hidden comment: Capacitor NP)
C45  value 1uF  Voltage: 25V  Package: 0805  [CAP_C_0805]  (hidden comment: Capacitor NP)
C46  value 4.7uF  Voltage: 10V  Package: 0805  [CAP_C_0805]  (hidden comment: Capacitor NP)
C47  value 1200uF  Voltage: 63V  Package: P7.5D16H31.5  [CAP_RAD_P7.5D16H31.5]  (hidden comment: Capacitor POL)
C48  value 0.1uF  Voltage: 50V  Package: 0603  [CAP_C_0603]  (hidden comment: Capacitor NP)
C49  value 0.1uF  Voltage: 50V  Package: 0603  [CAP_C_0603]  (hidden comment: Capacitor NP)
D1  value 7.5V  [SOD-123]  (hidden comment: Diode Zener)
D2  value 1N4148  [SOD-323]  (hidden comment: Diode Single)
D3  value BAT41  [SOD-123]  (hidden comment: Diode Schottky)
D11  value RED  [LED_0603_RED]  (hidden comment: LED_red)
D12  value GREEN  [LED_0603_GREEN]  (hidden comment: LED_green)
D13  value GREEN  [LED_0603_GREEN]  (hidden comment: LED_green)
J1  Header 1x5  [HDR_M_2.54_1x5]  (value not drawn)
J2  Header 1x5  [HDR_M_2.54_1x5]  (value not drawn)
J3  Header 2x4  [HDR_M_2.54_2x4]  (value not drawn)
J4  Header 1x6  [HDR_M_2.54_1x6]  (value not drawn)
J5  value XT30U-M 1x2  [CON TERMINAL XT30U-M 5mm 1x2 Male 30A TH V]  (hidden comment: CON 1x2 POLARIZED)
L1  value 56uH  [IND_WE_WE-PD_L7.3W7.3H4.5]  (hidden comment: Inductor)
Q7  value DMP3099  [SOT-23-3]  (hidden comment: Transistor MOS-P GSD)
Q8  value 2N7002-G  [SOT-23-3]  (hidden comment: Transistor MOS-N GSD)
R1  value 100k  [RES_C_0603]  (hidden comment: Resistor)
R5  value 140k  Package: 0805  Tolerance: 1%  [RES_C_0805]  (hidden comment: Resistor)
R6  value 10k  Package: 0805  Tolerance: 1%  [RES_C_0805]  (hidden comment: Resistor)
R16  value 3.3R  [RES_C_0805]  (hidden comment: Resistor)
R26  value 39k  Package: 0805  Tolerance: 1%  [RES_C_0805]  (hidden comment: Resistor)
R27  value 39k  Package: 0805  Tolerance: 1%  [RES_C_0805]  (hidden comment: Resistor)
R28  value 39k  Package: 0805  Tolerance: 1%  [RES_C_0805]  (hidden comment: Resistor)
R29  value 4.7k  [RES_C_0603]  (hidden comment: Resistor)
R30  value 4.7k  [RES_C_0603]  (hidden comment: Resistor)
R31  value 4.7k  [RES_C_0603]  (hidden comment: Resistor)
R32  value 0R  Package: 1206  [RES_C_1206]  (hidden comment: Resistor)
R33  value 2.4k  Package: 0603  Tolerance: 1%  [RES_C_0603]  (hidden comment: Resistor)
R34  value 2.4k  Package: 0603  Tolerance: 1%  [RES_C_0603]  (hidden comment: Resistor)
R35  value 2.4k  Package: 0603  Tolerance: 1%  [RES_C_0603]  (hidden comment: Resistor)
R36  value 36k  [RES_C_0805]  (hidden comment: Resistor)
R37  value 2.4k  [RES_C_0603]  (hidden comment: Resistor)
R40  value 2.61k  Package: 0603  Tolerance: 1%  [RES_C_0603]  (hidden comment: Resistor)
R45  value 2.61k  Package: 0603  Tolerance: 1%  [RES_C_0603]  (hidden comment: Resistor)
R46  value 2.2k  [RES_C_0603]  (hidden comment: Resistor)
R47  value 20k  Package: 0603  Tolerance: 1%  [RES_C_0603]  (hidden comment: Resistor)
R48  value 2.2k  [RES_C_0603]  (hidden comment: Resistor)
R49  value 2.2k  [RES_C_0603]  (hidden comment: Resistor)
R50  value 2.2k  [RES_C_0603]  (hidden comment: Resistor)
R51  value 2.2k  [RES_C_0603]  (hidden comment: Resistor)
R52  value 4.7k  [RES_C_0603]  (hidden comment: Resistor)
R54  value 2.2k  [RES_C_0603]  (hidden comment: Resistor)
R57  value 4.7k  [RES_C_0603]  (hidden comment: Resistor)
R58  value 4.7k  [RES_C_0603]  (hidden comment: Resistor)
R75  value 3.3R  [RES_C_0805]  (hidden comment: Resistor)
R76  value 3.3k  Package: 0603  Tolerance: 1%  [RES_C_0603]  (hidden comment: Resistor)
R77  value 10k  Package: 0603  Tolerance: 1%  [RES_C_0603]  (hidden comment: Resistor)
R78  value 10k  Package: 0603  Tolerance: 1%  [RES_C_0603]  (hidden comment: Resistor)
R79  value 10k  Package: 0603  Tolerance: 1%  [RES_C_0603]  (hidden comment: Resistor)
R80  value 36k  [RES_C_0805]  (hidden comment: Resistor)
R81  value 7.5k  Package: 0603  Tolerance: 1%  [RES_C_0603]  (hidden comment: Resistor)
R82  value 1.2k  Package: 0603  Tolerance: 1%  [RES_C_0603]  (hidden comment: Resistor)
R83  value 10k  Package: 0603  Tolerance: 1%  [RES_C_0603]  (hidden comment: Resistor)
TH1  value 10k  Package: P2.54  Tolerance: 1%  [Thermistor_Wired_P1.5]  (hidden comment: Thermistor NTC)
TP11  Test Point No BOM  [TP_3.4x5_SMD_NOBOM]  (value not drawn)  (no BOM)
U2  value MCP1754S-5V  [SOT-23A-3]  (hidden comment: MCP1754ST-5002ECB SOT-23A-3)
U3  value MCP16331  [SOT-23-6]  (hidden comment: MCP16331 SOT-23-6)
U4  value MCP1754S/3.3V  [SOT-223-3]  (hidden comment: MCP1754S SOT-89-3_SOT-223-3)

### Blocks framed on the sheet
BEMF: C16 C17 C38 R26-R28 R33-R35

### Nets
+3V3: C12.2 J2.2(P2) J3.2 J4.2 R29.2 R30.2 R31.2 R40.2 R46.2 R48.2 R52.2 R54.2 R57.2 R58.2 R76.2 R78.2 R79.2 U4.3(VOUT)
+5V: C46.2 C48.1 J1.1(P1) U2.2(VOUT)
+12V: C2.1 D1.2(K) L1.1(S) Q7.2(S) R5.1 R16.1 R77.2
+12V_SW: Q7.3(D) R47.2 R75.1 R80.2
GND: C2.2 C6.1 C7.1 C11.1 C12.1 C16.1 C17.1 C19.1 C34.1 C38.1 C41.1 C42.1 C43.1 C44.1 C45.1 C46.1 C47.2 C48.2 C49.2 D3.1(A) D11.2(K) D12.2(K) D13.2(K) J1.5(P5) J2.3(P3) J3.6 J4.3 J5.2 Q8.2(S) R6.2 R33.1 R34.1 R35.1 R37.1 R81.1 R83.1 TH1.1 TP11.1 U2.1(GND) U3.2(GND) U4.2(GND)
VBUS: C47.1 J5.1 R32.2 R36.2
+12V/16: C44.2 R80.1 R81.2
~{FAULT}: R45.2
~{MCLR}: J2.1(P1)
A: R27.2
AUX3: J3.5 R57.1
AUX4: J3.8 R29.1
AUX5: J3.3 R30.1
AUX6: J3.1 R31.1
AUX7: J3.7 R52.1
B: R26.2
BEMF_A: C16.2 R27.1 R34.2
BEMF_B: C38.2 R26.1 R33.2
BEMF_C: C17.2 R28.1 R35.2
C: R28.2
HALL1: C43.2 R49.2
HALL2: C42.2 R50.2
HALL3: C41.2 R51.2
PGEC: J2.5(P5)
PGED: J2.4(P4)
SCL: J4.4 R78.1
SDA: J4.5 R79.1
SW_12V: Q8.1(G) R83.2
TEMPERATURE: C49.1 R76.1 TH1.2
THROTTLE: C34.2 J3.4 R58.1
UART_RX: J4.1
UART_TX: J4.6
VBUS/16: C19.2 R36.1 R37.2
NetC1_1: C1.1 D3.2(K) L1.2(F) U3.6(SW)
NetC1_2: C1.2 D2.2(K) U3.1(BOOST)
NetC6_2: C6.2 C7.2 R1.2 R32.1 U3.5(VIN)
NetC11_2: C11.2 R16.2 U4.1(VIN)
NetC45_2: C45.2 R75.2 U2.3(VIN)
NetD1_1: D1.1(A) D2.1(A)
NetD11_1: D11.1(A) R45.1
NetD12_1: D12.1(A) R40.1
NetD13_1: D13.1(A) R47.1
NetJ1_2: J1.2(P2) R48.1 R49.1
NetJ1_3: J1.3(P3) R50.1 R54.1
NetJ1_4: J1.4(P4) R46.1 R51.1
NetQ7_1: Q7.1(G) R77.1 R82.2
NetQ8_3: Q8.3(D) R82.1
NetR1_1: R1.1 U3.4(EN)
NetR5_2: R5.2 R6.1 U3.3(VFB)

### Notes on the sheet
- POWER SUPPLY
- (near R76) TEMPERATURE
- VOLTAGE MONITORING
- THROTTLE & AUX
- PROGRAMMER/DEBUG
- UART/I2C
- HALL
- (near J1) HALL A
- (near J1) HALL B
- (near J1) HALL C
- Drawn By:
- Engineer:
- PartNumber:
- Project Title
- Variant:
- Sheet Title
- Size
- B
- SCH #:
- PCB #:
- Rev:
- Date:
- Sheet
- Designed with
- Altium.com <http://go.altium.com/MicrochipLandingPage_Evaluation.html>
- File:
- (in symbol CON2207) (+); (-)
- (in symbol RES2734) -t